# EAGLE design analog-daughter (EAGLE 6.6.0)
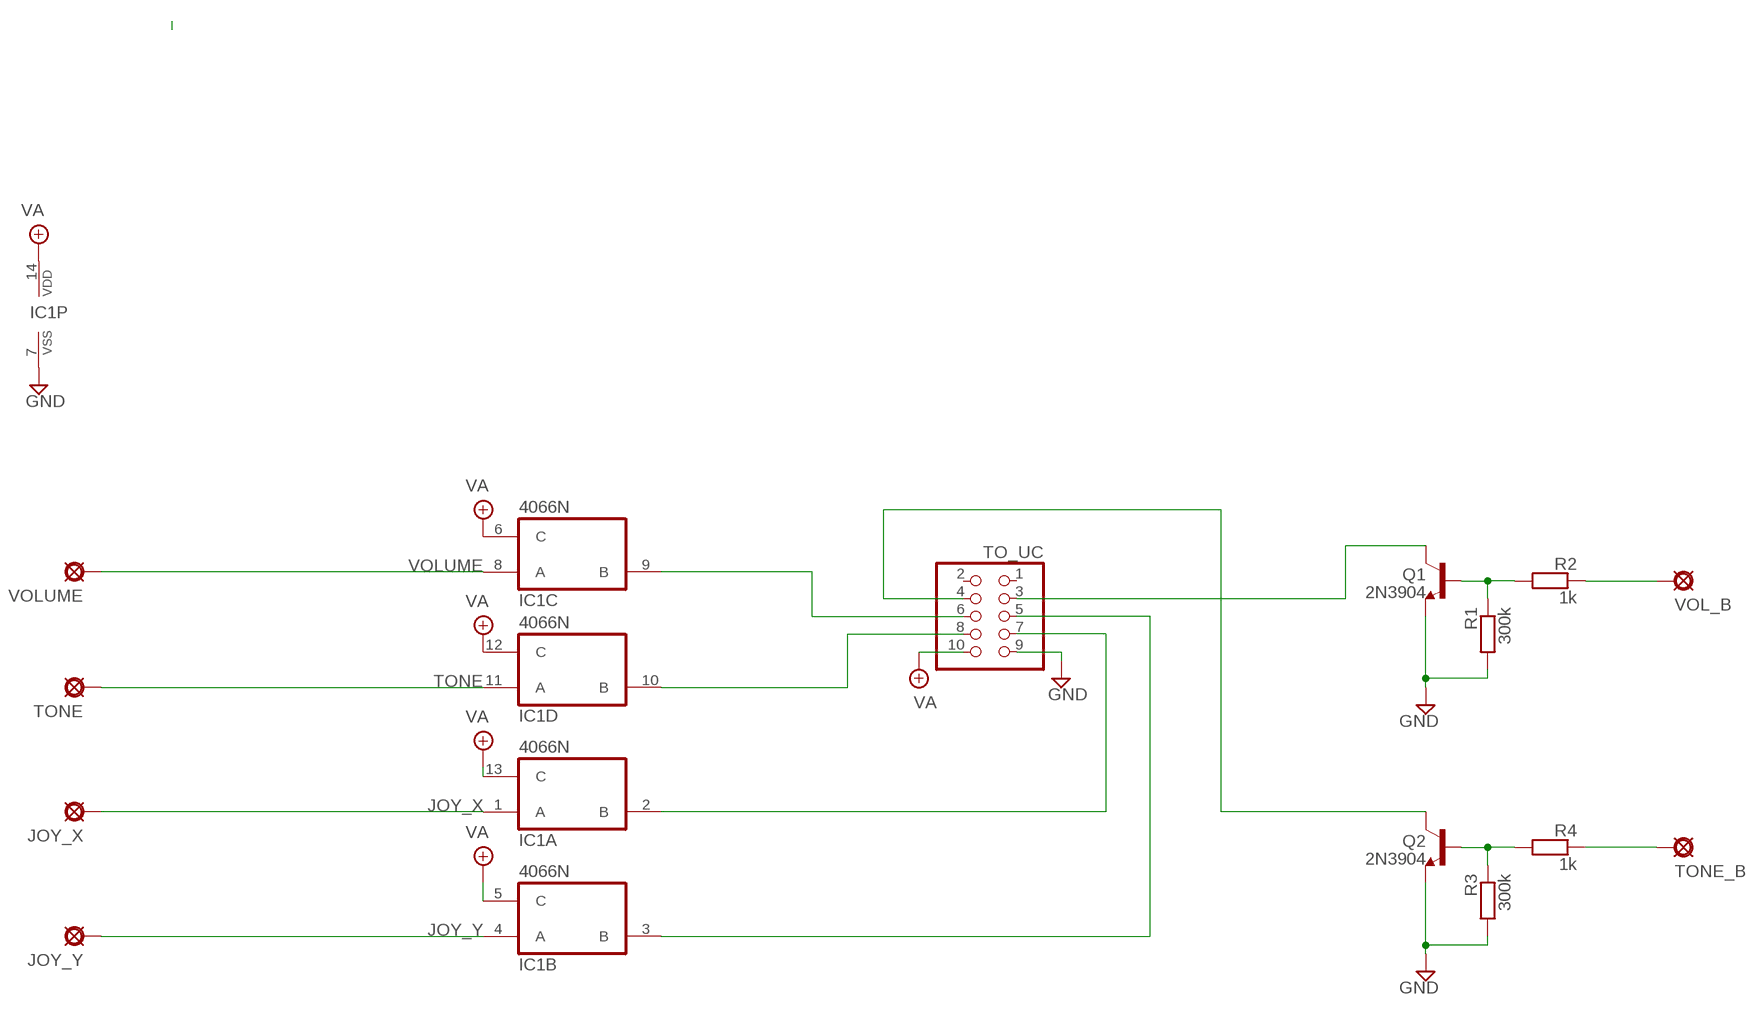
[diagram p0: schematic, sheet 1]

## Parts
IC1  4066N  [DIL14]
JOY_X  PAD  [SQUARE]
JOY_Y  PAD  [SQUARE]
Q1  2N3904  [TO92-]
Q2  2N3904  [TO92-]
R1  300k  6MM-EU1  [R0207/1V]
R2  1k  6MM-EU1  [R0207/1V]
R3  300k  6MM-EU1  [R0207/1V]
R4  1k  6MM-EU1  [R0207/1V]
TO_UC  PINHD-2X5  [2X05]
TONE  PAD  [SQUARE]
TONE_B  PAD  [SQUARE]
VOL_B  PAD  [SQUARE]
VOLUME  PAD  [SQUARE]

## Nets
GND: IC1.7(P:VSS) Q1.3(E) Q2.3(E) R1.2 R3.2 TO_UC.9
JOY_X: IC1.1(A:A) JOY_X.1(PAD)
JOY_Y: IC1.4(B:A) JOY_Y.1(PAD)
N$2: Q1.1(C) TO_UC.3
N$3: IC1.9(C:B) TO_UC.6
N$4: IC1.10(D:B) TO_UC.8
N$5: IC1.2(A:B) TO_UC.7
N$6: IC1.3(B:B) TO_UC.5
N$9: Q2.1(C) TO_UC.4
N$11: Q1.2(B) R1.1 R2.2
N$12: Q2.2(B) R3.1 R4.2
TONE: IC1.11(D:A) TONE.1(PAD)
TONE_BUTTON: R4.1 TONE_B.1(PAD)
VA: IC1.5(B:C) IC1.6(C:C) IC1.12(D:C) IC1.13(A:C) IC1.14(P:VDD) TO_UC.10
VOL_BUTTON: R2.1 VOL_B.1(PAD)
VOLUME: IC1.8(C:A) VOLUME.1(PAD)
Unconnected: TO_UC.1 TO_UC.2

## Library data of the parts
IC1 = 40xx:4066: Quad bilateral ANALOG SWITCH
JOY_X JOY_Y TONE TONE_B VOL_B VOLUME = gm-supply:PAD: PAD use this package for pads with any purpose, including input, output, send or return various pad shapes: round, square, octogonal, long, and long offset
Q1 Q2 = gm-trans:2N3904: NPN Transistor
R1-R4 = gm-resistors:6MM-EU: 6mm Resistors (European schematic symbol) Leads spaced 1-6 holes apart for 0.1" perfboard. Suitable for 1/4 watt resistors.
TO_UC = pinhead:PINHD-2X5: PIN HEADER

## Board
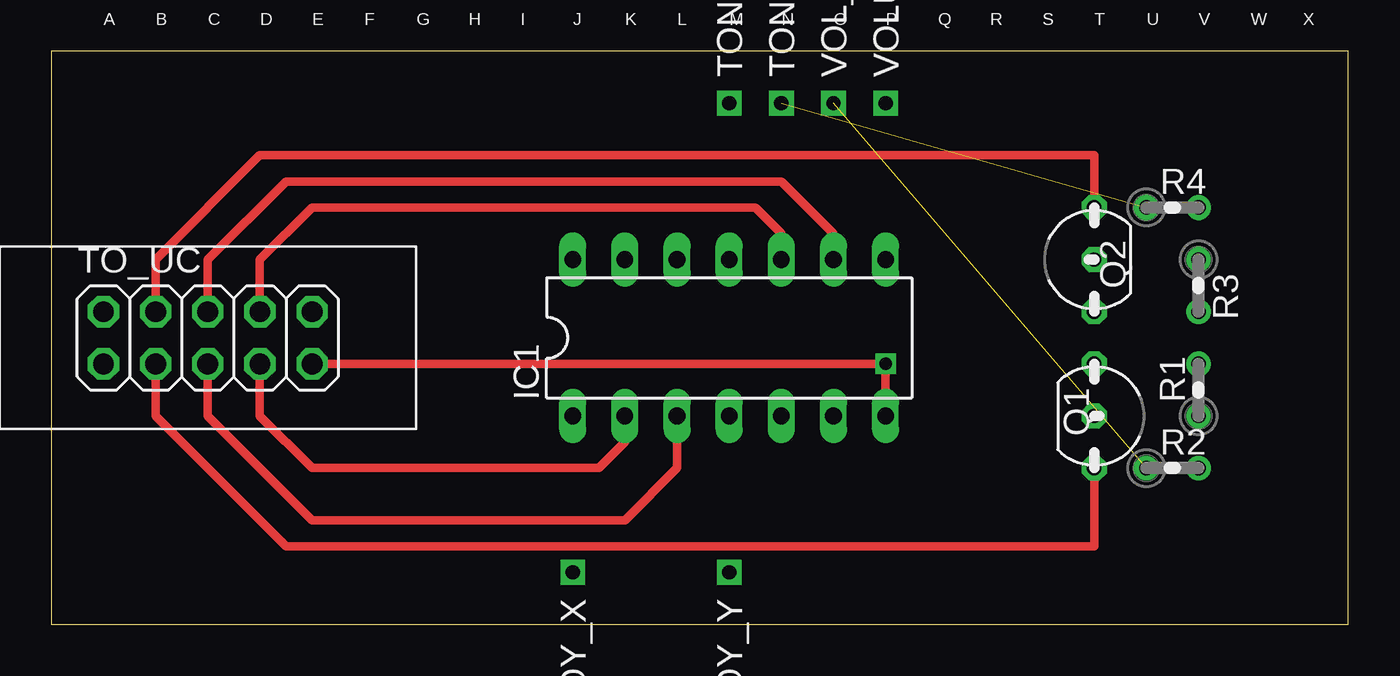
[diagram p1: board, top side]
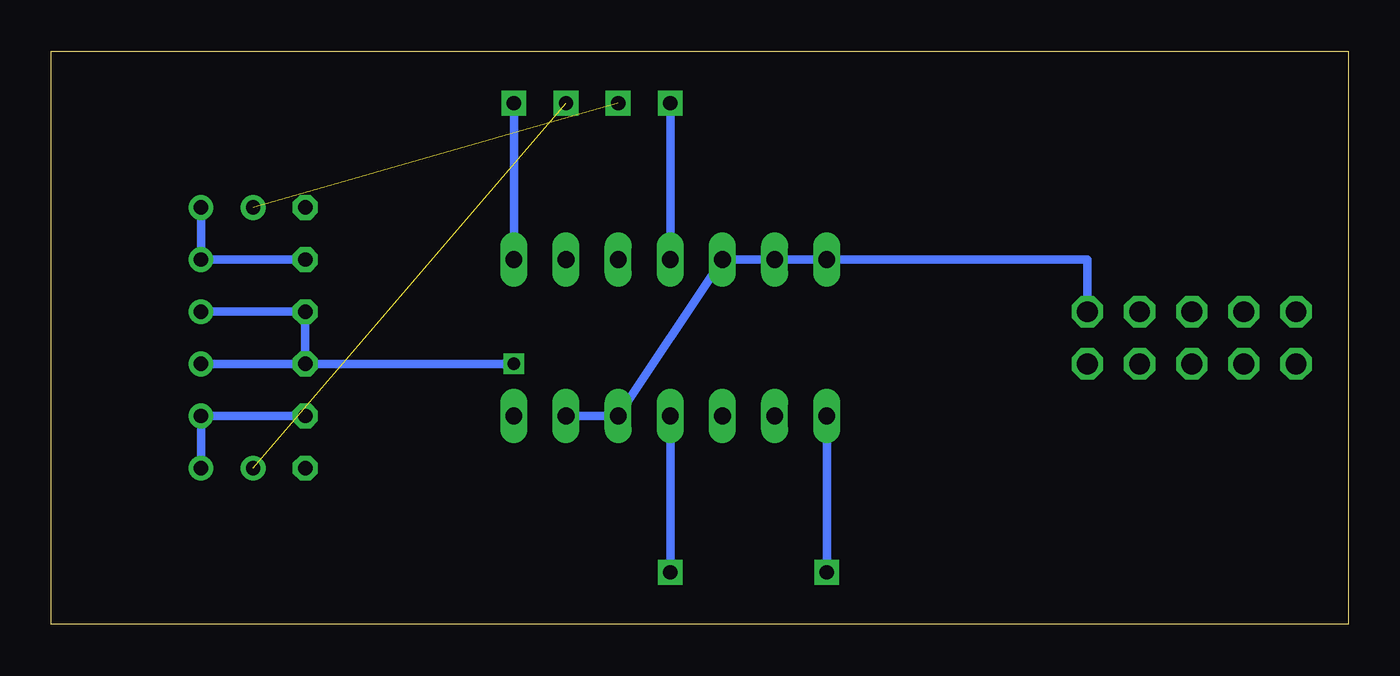
[diagram p2: board, bottom side, seen from below]

Size 63.17 x 27.93 mm. Coordinates in mm from the lower left corner, seen from the top.
Outline: 0,0 63.17,0 63.17,27.93 0,27.93 0,0
Copper layers (1*16): Top 0.035mm / dielectric 1.5mm / Bottom 0.035mm
Design rules "default": minimum track width 10mil, minimum drill 24mil, track to track 8mil, track to pad 8mil, pad to pad 8mil, via to via 8mil, smd to smd 8mil, copper to edge 40mil, drill to drill 8mil, minimum pad ring 10mil, minimum via ring 8mil, stop-mask expansion 4mil, vias tented up to drill 0mil, thermal gap 10mil

### Footprints (pad centres in the part's own frame; a part is rotated, then mirrored left to right if it is on the bottom)
DIL14 = drill 0.813 long: 1 -7.62,-3.81; 2 -5.08,-3.81; 3 -2.54,-3.81; 4 0,-3.81; 5 2.54,-3.81; 6 5.08,-3.81; 7 7.62,-3.81; 8 7.62,3.81; 9 5.08,3.81; 10 2.54,3.81; 11 0,3.81; 12 -2.54,3.81; 13 -5.08,3.81; 14 -7.62,3.81
SQUARE = drill 0.7 square: 1 0,0
TO92- = drill 0.7 octagon: 1 2.54,0; 2 0,0; 3 -2.54,0
R0207/1V = drill 0.7: 1 -1.27,0; 2 1.27,0
2X05 = drill 1.016 octagon: 1 -5.08,-1.27; 2 -5.08,1.27; 3 -2.54,-1.27; 4 -2.54,1.27; 5 0,-1.27; 6 0,1.27; 7 2.54,-1.27; 8 2.54,1.27; 9 5.08,-1.27; 10 5.08,1.27

### Placement (x,y rotation side)
IC1  33.02,13.97 0 top
JOY_X  25.4,2.54 270 top
JOY_Y  33.02,2.54 270 top
Q1  50.8,10.16 270 top
Q2  50.8,17.78 90 top
R1  55.88,11.43 90 top
R2  54.61,7.62 0 top
R3  55.88,16.51 270 top
R4  54.61,20.32 0 top
TO_UC  7.62,13.97 0 top
TONE  33.02,25.4 90 top
TONE_B  35.56,25.4 90 top
VOL_B  38.1,25.4 90 top
VOLUME  40.64,25.4 90 top

### Tracks (layer width: path | path; a pad name or v marks a point on that pad's centre or on a via)
GND  (via drill 0.6)
  Top 0.406: TO_UC.9 v40.64,12.7 IC1.7
  Bottom 0.406: R3.2 Q2.3 Q1.3 | R1.2 Q1.3 | v40.64,12.7 Q1.3
JOY_X
  Bottom 0.406: IC1.1 JOY_X.1
JOY_Y
  Bottom 0.406: IC1.4 JOY_Y.1
N$2
  Top 0.406: TO_UC.3 5.08,10.16 11.43,3.81 50.8,3.81 Q1.1
N$3
  Top 0.406: TO_UC.6 7.62,17.78 11.43,21.59 35.56,21.59 38.1,19.05 IC1.9
N$4
  Top 0.406: TO_UC.8 10.16,17.78 12.7,20.32 34.29,20.32 35.56,19.05 IC1.10
N$5
  Top 0.406: IC1.2 27.94,8.89 26.67,7.62 12.7,7.62 10.16,10.16 TO_UC.7
N$6
  Top 0.406: TO_UC.5 7.62,10.16 12.7,5.08 27.94,5.08 30.48,7.62 IC1.3
N$9
  Top 0.406: Q2.1 50.8,22.86 10.16,22.86 5.08,17.78 TO_UC.4
N$11
  Bottom 0.406: Q1.2 R1.1 R2.2
N$12
  Bottom 0.406: Q2.2 R3.1 R4.2
TONE
  Bottom 0.406: TONE.1 IC1.11
TONE_BUTTON  (1 unrouted)
VA
  Bottom 0.406: IC1.6 IC1.5 IC1.12 IC1.13 IC1.14 12.7,17.78 TO_UC.10
VOL_BUTTON  (1 unrouted)
VOLUME
  Bottom 0.406: VOLUME.1 IC1.8

### Text on the board
tNames: A | B | C | D | E | F | G | H | I | J | K | L | M | N | O | P | Q | R | S | T | U | V | W | X